# EAGLE schematic OutputBoard (EAGLE 7.2.0)
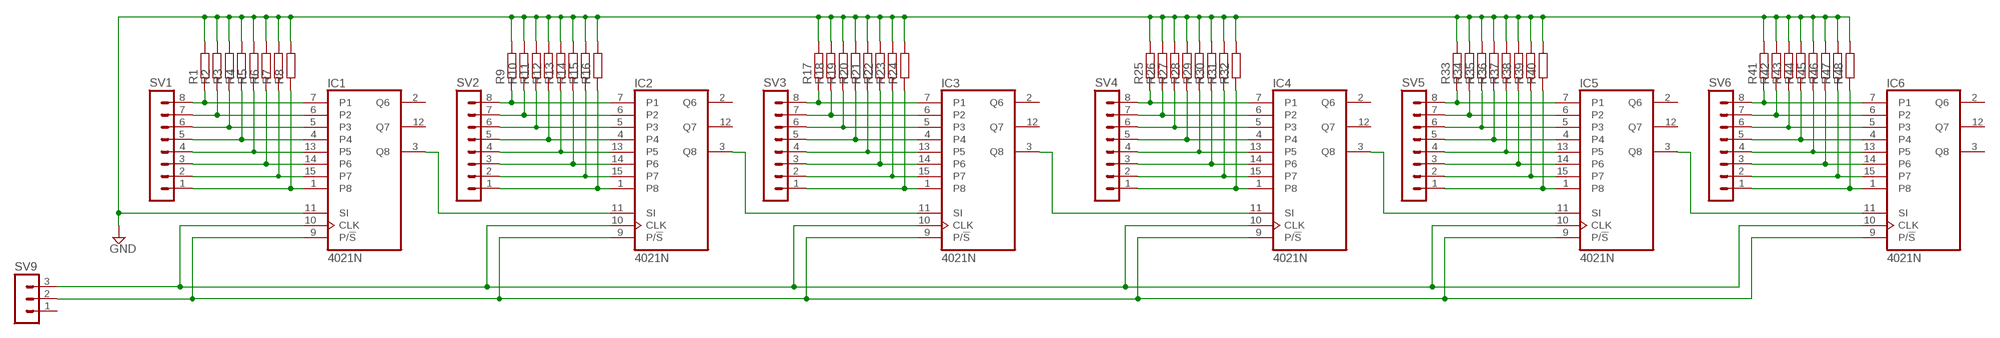
[diagram p0: schematic, sheet 1]

## Parts
IC1  4021N  [DIL16]
IC2  4021N  [DIL16]
IC3  4021N  [DIL16]
IC4  4021N  [DIL16]
IC5  4021N  [DIL16]
IC6  4021N  [DIL16]
R1  R-EU_0207/10  [0207/10]
R2  R-EU_0207/10  [0207/10]
R3  R-EU_0207/10  [0207/10]
R4  R-EU_0207/10  [0207/10]
R5  R-EU_0207/10  [0207/10]
R6  R-EU_0207/10  [0207/10]
R7  R-EU_0207/10  [0207/10]
R8  R-EU_0207/10  [0207/10]
R9  R-EU_0207/10  [0207/10]
R10  R-EU_0207/10  [0207/10]
R11  R-EU_0207/10  [0207/10]
R12  R-EU_0207/10  [0207/10]
R13  R-EU_0207/10  [0207/10]
R14  R-EU_0207/10  [0207/10]
R15  R-EU_0207/10  [0207/10]
R16  R-EU_0207/10  [0207/10]
R17  R-EU_0207/10  [0207/10]
R18  R-EU_0207/10  [0207/10]
R19  R-EU_0207/10  [0207/10]
R20  R-EU_0207/10  [0207/10]
R21  R-EU_0207/10  [0207/10]
R22  R-EU_0207/10  [0207/10]
R23  R-EU_0207/10  [0207/10]
R24  R-EU_0207/10  [0207/10]
R25  R-EU_0207/10  [0207/10]
R26  R-EU_0207/10  [0207/10]
R27  R-EU_0207/10  [0207/10]
R28  R-EU_0207/10  [0207/10]
R29  R-EU_0207/10  [0207/10]
R30  R-EU_0207/10  [0207/10]
R31  R-EU_0207/10  [0207/10]
R32  R-EU_0207/10  [0207/10]
R33  R-EU_0207/10  [0207/10]
R34  R-EU_0207/10  [0207/10]
R35  R-EU_0207/10  [0207/10]
R36  R-EU_0207/10  [0207/10]
R37  R-EU_0207/10  [0207/10]
R38  R-EU_0207/10  [0207/10]
R39  R-EU_0207/10  [0207/10]
R40  R-EU_0207/10  [0207/10]
R41  R-EU_0207/10  [0207/10]
R42  R-EU_0207/10  [0207/10]
R43  R-EU_0207/10  [0207/10]
R44  R-EU_0207/10  [0207/10]
R45  R-EU_0207/10  [0207/10]
R46  R-EU_0207/10  [0207/10]
R47  R-EU_0207/10  [0207/10]
R48  R-EU_0207/10  [0207/10]
SV1  MA08-1  [MA08-1]
SV2  MA08-1  [MA08-1]
SV3  MA08-1  [MA08-1]
SV4  MA08-1  [MA08-1]
SV5  MA08-1  [MA08-1]
SV6  MA08-1  [MA08-1]
SV9  MA03-1  [MA03-1]

## Nets
GND: IC1.11(SI) IC3.3(Q8) IC4.11(SI) R1.2 R2.2 R3.2 R4.2 R5.2 R6.2 R7.2 R8.2 R9.2 R10.2 R11.2 R12.2 R13.2 R14.2 R15.2 R16.2 R17.2 R18.2 R19.2 R20.2 R21.2 R22.2 R23.2 R24.2 R25.2 R26.2 R27.2 R28.2 R29.2 R30.2 R31.2 R32.2 R33.2 R34.2 R35.2 R36.2 R37.2 R38.2 R39.2 R40.2 R41.2 R42.2 R43.2 R44.2 R45.2 R46.2 R47.2 R48.2
N$1: IC4.7(P1) R25.1 SV4.8
N$2: IC1.10(CLK) IC2.10(CLK) IC3.10(CLK) IC4.10(CLK) IC5.10(CLK) IC6.10(CLK) SV9.3
N$3: IC1.3(Q8) IC2.11(SI)
N$4: IC2.7(P1) R9.1 SV2.8
N$5: IC4.5(P3) R27.1 SV4.6
N$6: IC2.5(P3) R11.1 SV2.6
N$7: IC2.4 R12.1 SV2.5
N$8: IC2.13(P5) R13.1 SV2.4
N$9: IC2.14(P6) R14.1 SV2.3
N$10: IC1.7(P1) R1.1 SV1.8
N$11: IC1.6(P2) R2.1 SV1.7
N$12: IC1.5(P3) R3.1 SV1.6
N$13: IC1.4 R4.1 SV1.5
N$14: IC1.13(P5) R5.1 SV1.4
N$15: IC1.14(P6) R6.1 SV1.3
N$16: IC1.15(P7) R7.1 SV1.2
N$17: IC1.1(P8) R8.1 SV1.1
N$18: IC2.15(P7) R15.1 SV2.2
N$19: IC2.6(P2) R10.1 SV2.7
N$20: IC2.1(P8) R16.1 SV2.1
N$21: IC3.7(P1) R17.1 SV3.8
N$22: IC3.5(P3) R19.1 SV3.6
N$23: IC1.9(P/!S) IC2.9(P/!S) IC3.9(P/!S) IC4.9(P/!S) IC5.9(P/!S) IC6.9(P/!S) SV9.2
N$24: IC3.4 R20.1 SV3.5
N$25: IC3.13(P5) R21.1 SV3.4
N$26: IC3.14(P6) R22.1 SV3.3
N$27: IC3.15(P7) R23.1 SV3.2
N$28: IC3.6(P2) R18.1 SV3.7
N$29: IC3.1(P8) R24.1 SV3.1
N$30: IC4.4 R28.1 SV4.5
N$31: IC2.3(Q8) IC3.11(SI)
N$32: IC4.13(P5) R29.1 SV4.4
N$33: IC4.14(P6) R30.1 SV4.3
N$34: IC4.15(P7) R31.1 SV4.2
N$35: IC4.6(P2) R26.1 SV4.7
N$36: IC4.1(P8) R32.1 SV4.1
N$38: IC5.7(P1) R33.1 SV5.8
N$39: IC5.5(P3) R35.1 SV5.6
N$40: IC5.4 R36.1 SV5.5
N$41: IC5.13(P5) R37.1 SV5.4
N$42: IC5.14(P6) R38.1 SV5.3
N$43: IC5.15(P7) R39.1 SV5.2
N$44: IC5.6(P2) R34.1 SV5.7
N$45: IC5.1(P8) R40.1 SV5.1
N$47: IC4.3(Q8) IC5.11(SI)
N$48: IC6.7(P1) R41.1 SV6.8
N$49: IC6.5(P3) R43.1 SV6.6
N$50: IC6.4 R44.1 SV6.5
N$51: IC6.13(P5) R45.1 SV6.4
N$52: IC6.14(P6) R46.1 SV6.3
N$53: IC6.15(P7) R47.1 SV6.2
N$54: IC6.6(P2) R42.1 SV6.7
N$55: IC6.1(P8) R48.1 SV6.1
N$56: IC5.3(Q8) IC6.11(SI)
Unconnected: IC1.2(Q6) IC1.12(Q7) IC2.2(Q6) IC2.12(Q7) IC3.2(Q6) IC3.12(Q7) IC4.2(Q6) IC4.12(Q7) IC5.2(Q6) IC5.12(Q7) IC6.2(Q6) IC6.3(Q8) IC6.12(Q7) SV9.1

## Power pins joined to a net without a drawn wire
VDD: IC1.16(VDD) IC2.16(VDD) IC3.16(VDD) IC4.16(VDD) IC5.16(VDD) IC6.16(VDD)
VSS: IC1.8(VSS) IC2.8(VSS) IC3.8(VSS) IC4.8(VSS) IC5.8(VSS) IC6.8(VSS)

## Library data of the parts
IC1-IC6 = 40xx:4021: 8-bit static SHIFT REGISTER
R1-R48 = rcl:R-EU_: RESISTOR, European symbol
SV1-SV6 = con-lstb:MA08-1: PIN HEADER; OC_FARNELL: unknown; OC_NEWARK: unknown
SV9 = con-lstb:MA03-1: PIN HEADER; OC_FARNELL: unknown; OC_NEWARK: unknown

## Net classes
0 default: width 0.5 mm, drill 1 mm, clearance 0.5 mm